# EasyEDA schematic SCH-Display_EasyEDA.json

## Sheets
1 Display_Sheet_1: TITLE: Sheet_1; REV: 1.0; Date: 2024-01-01; Sheet: 1/2; Drawn By: scottguiness; Company: Scott and Marco
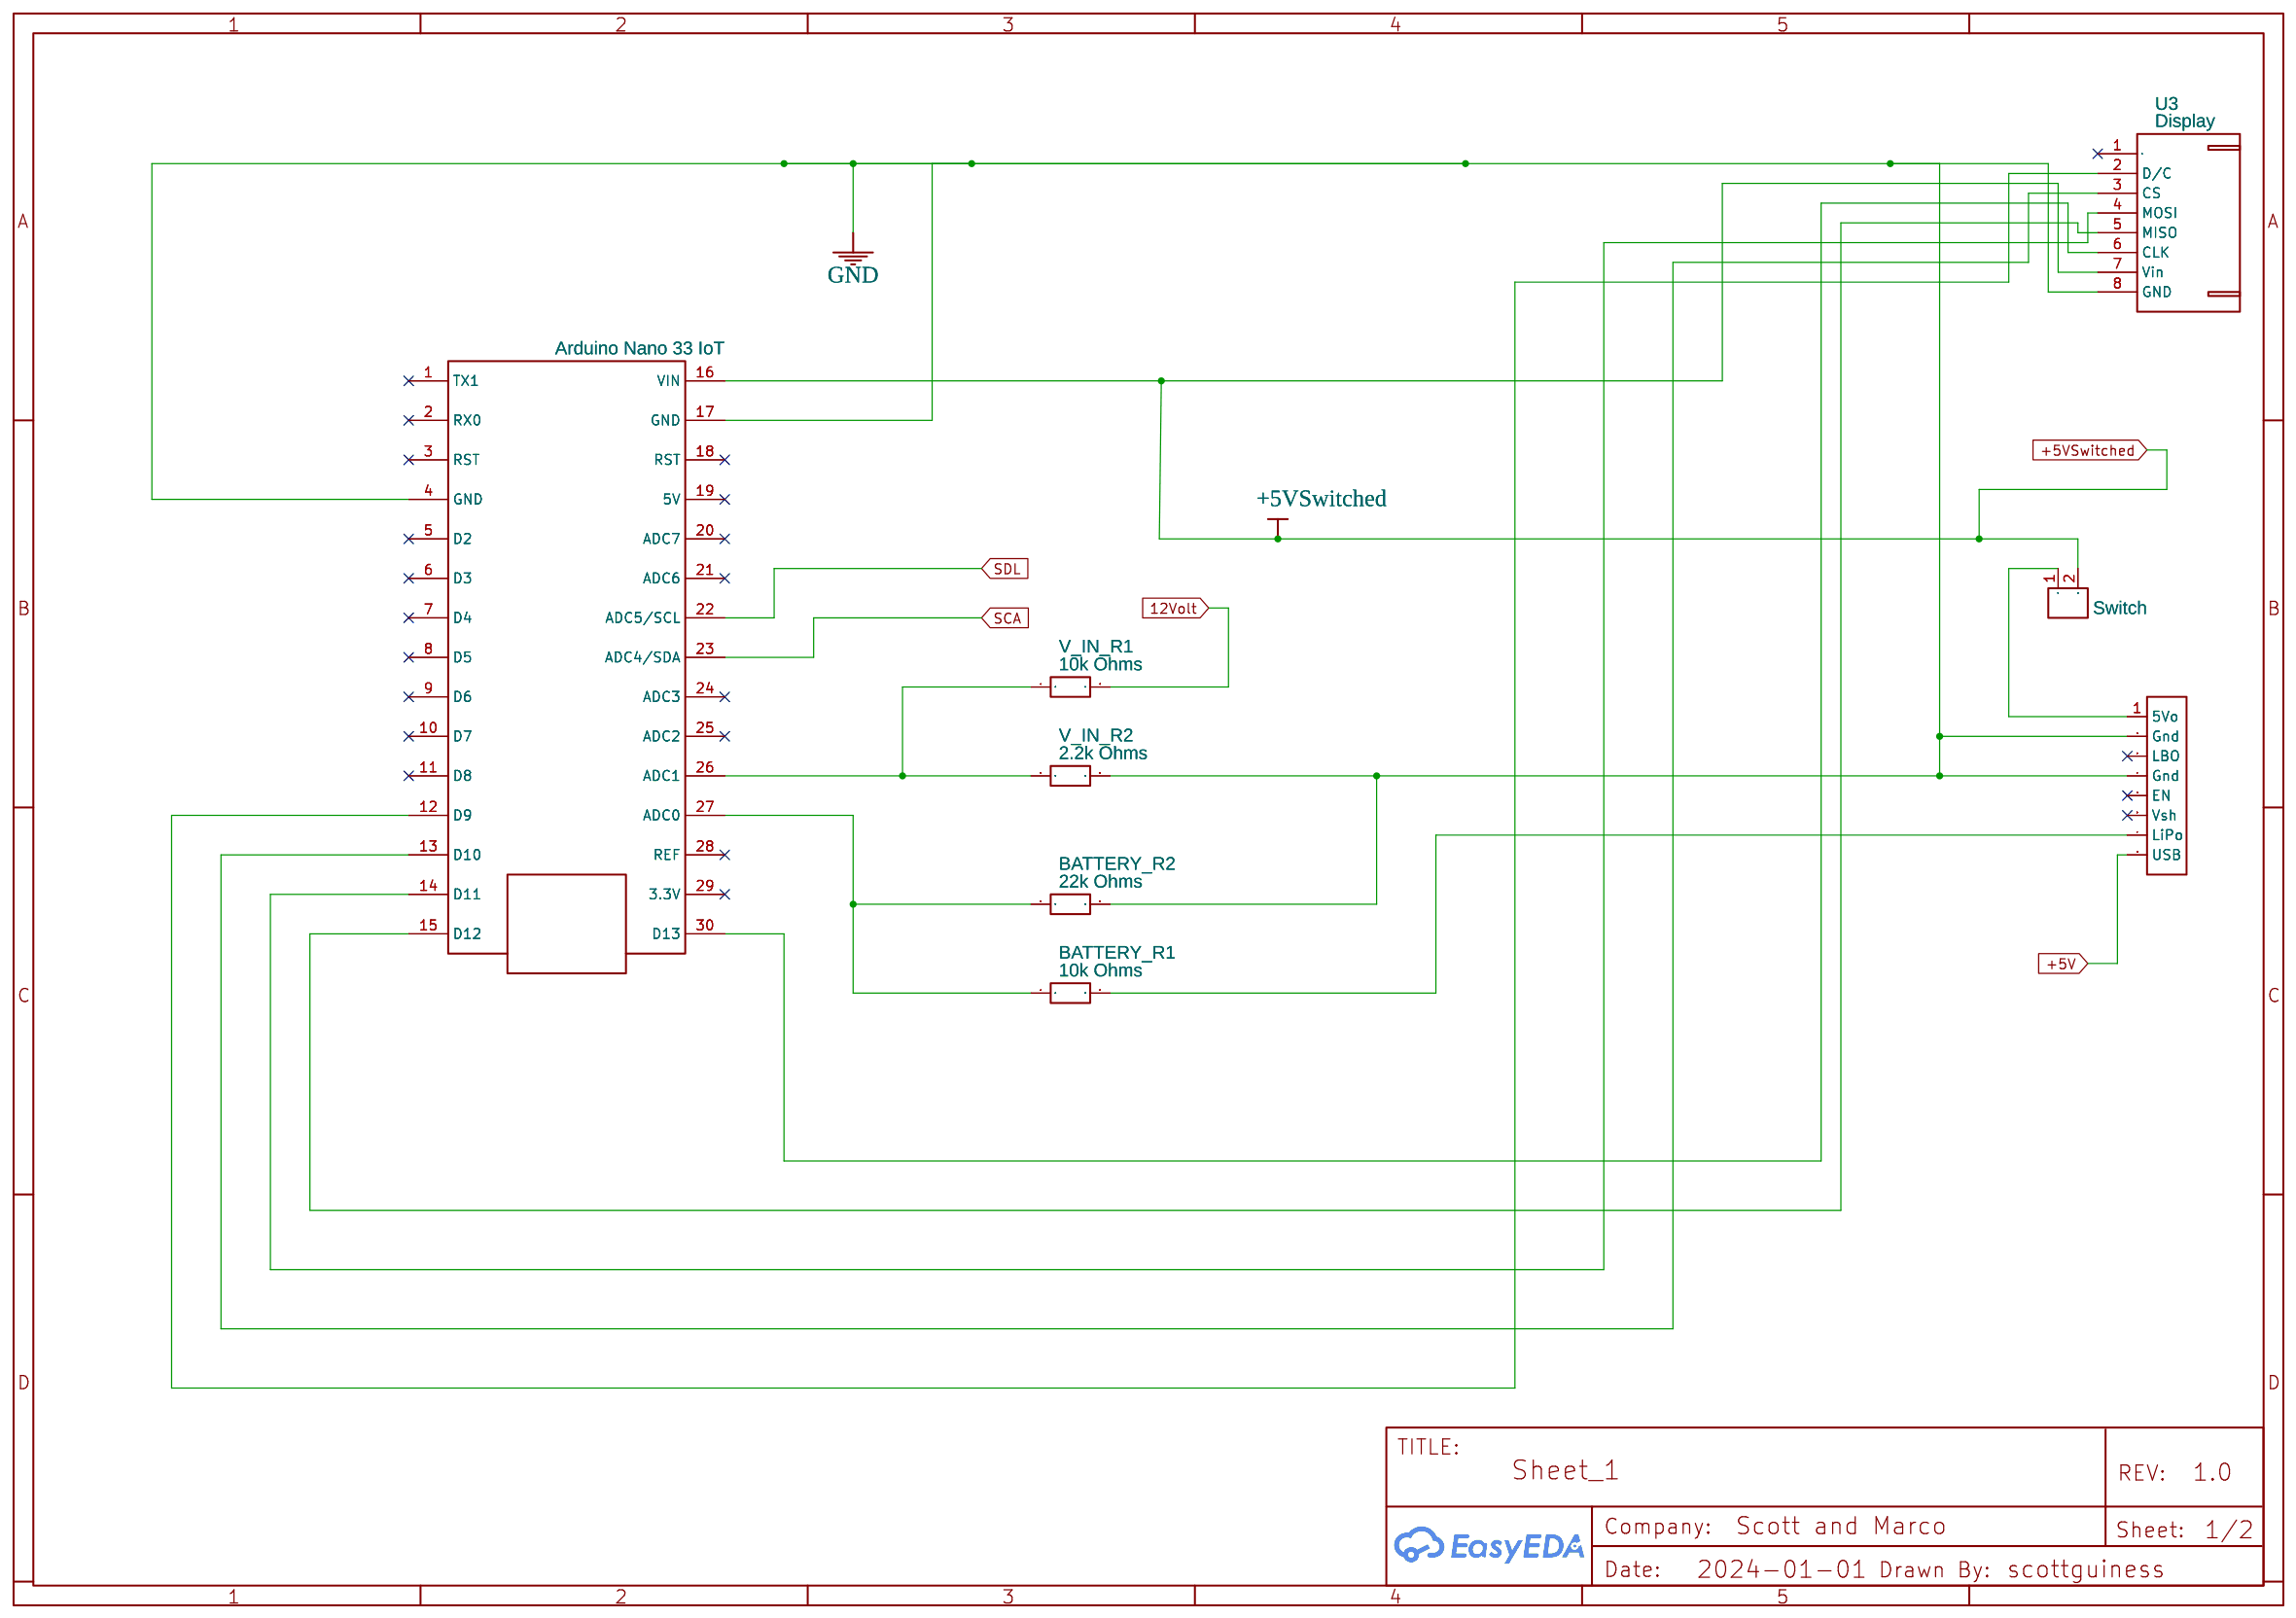
[diagram p0: Display_Sheet_1]
2 Display_Sheet_2: TITLE: Sheet_2; Date: 2024-01-03; Sheet: 2/2
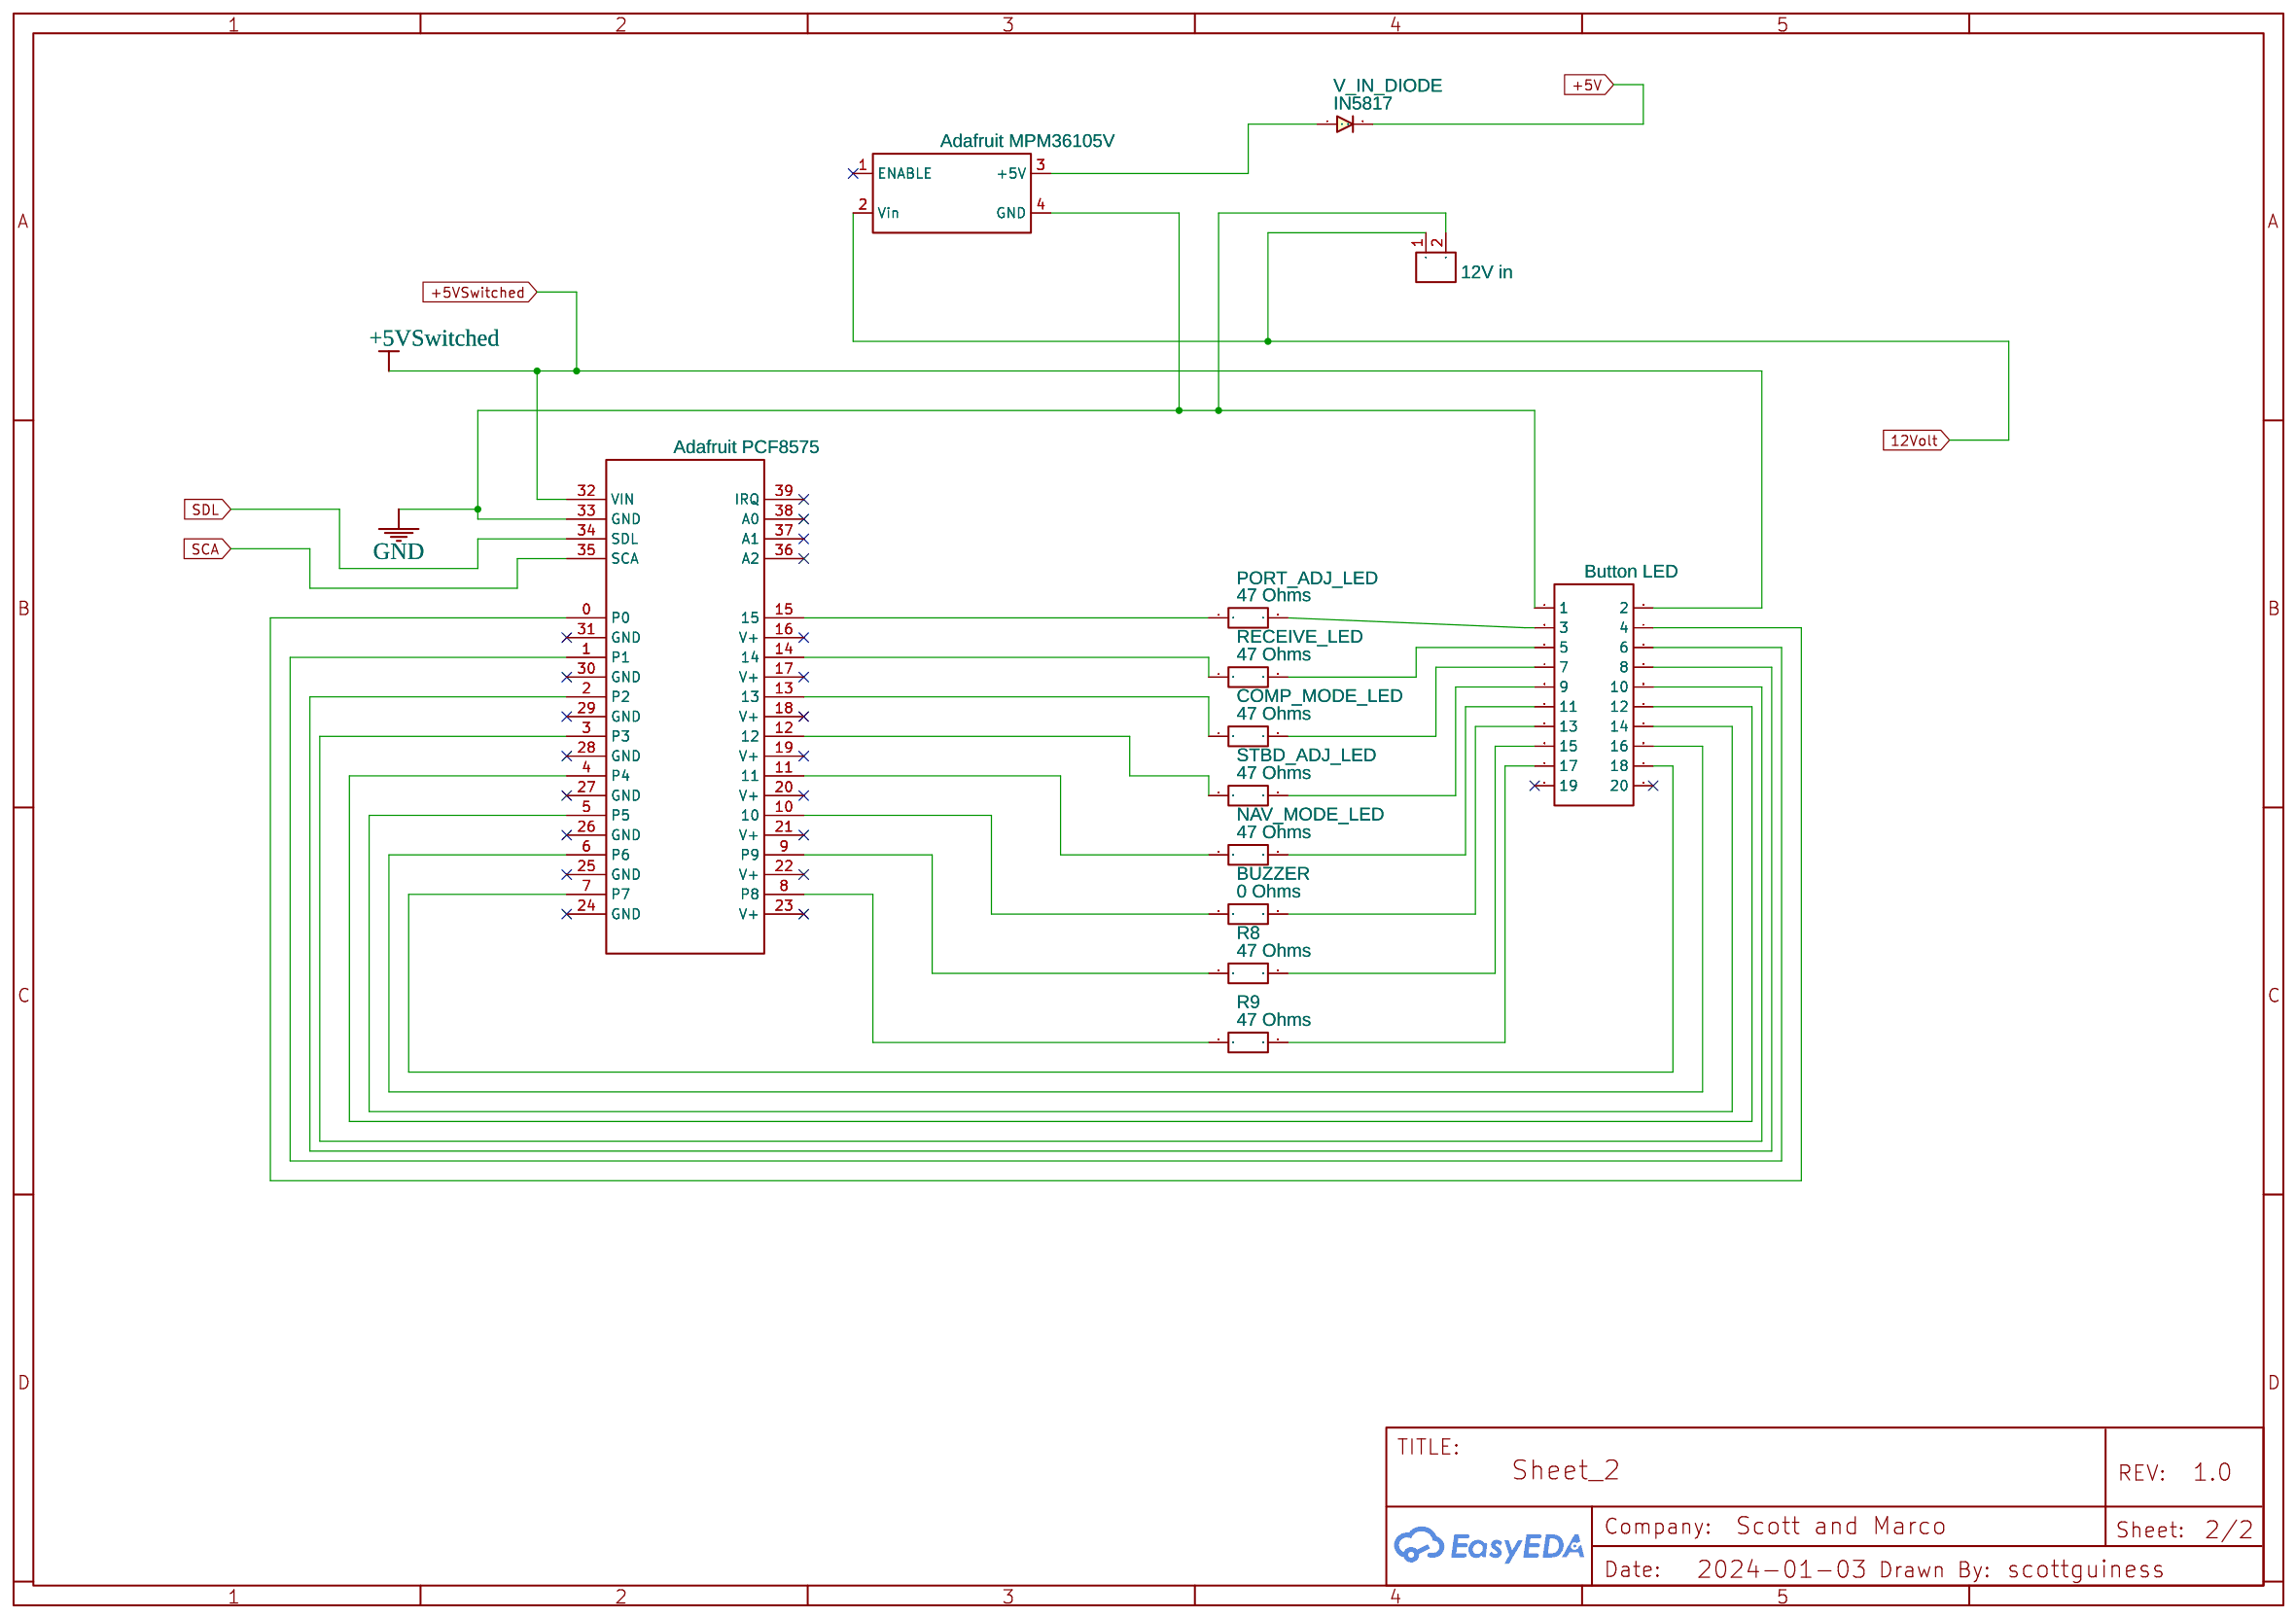
[diagram p1: Display_Sheet_2]

## Parts
sheet Display_Sheet_1
BATTERY_R1  10k Ohms  [2W RESITOR]
BATTERY_R2  22k Ohms  [2W RESITOR]
POWERBOOST  HDR-F-2.54_1x8  [HDR-F-2.54_1X8]
SWITCH  Switch  [JST-XHP-2-PIN]
U1  Arduino Nano 33 IoT  [ADUINO NANO R3]
U3  Display  [JST-XH-8-PIN]
V_IN_R1  10k Ohms  [2W RESITOR]
V_IN_R2  2.2k Ohms  [2W RESITOR]
sheet Display_Sheet_2
12V  12V in  [JST-XHP-2-PIN]
BUTTON_LED  Button LED  [HDR-M-2.54_2X10]
BUZZER  0 Ohms  [2W RESITOR]
COMP_MODE_LED  47 Ohms  [2W RESITOR]
NAV_MODE_LED  47 Ohms  [2W RESITOR]
PORT_ADJ_LED  47 Ohms  [2W RESITOR]
R8  47 Ohms  [2W RESITOR]
R9  47 Ohms  [2W RESITOR]
RECEIVE_LED  47 Ohms  [2W RESITOR]
STBD_ADJ_LED  47 Ohms  [2W RESITOR]
U2  Adafruit PCF8575  [ADAFRUIT-PCF8575]
U5  Adafruit MPM36105V  [ADAFRUIT_MPM3610_MODULE5]
V_IN_DIODE  IN5817  [DIODE NI RAMON]

## Library data of the parts
BATTERY_R1 BATTERY_R2 BUZZER COMP_MODE_LED NAV_MODE_LED PORT_ADJ_LED R8 R9 RECEIVE_LED STBD_ADJ_LED V_IN_R1 V_IN_R2 = 1w resistor: Contributor: Kagutsuchi
POWERBOOST = HDR-F-2.54_1x8: Supplier Part: C225505; Supplier: LCSC; Contributor: LCEDA_Lib
12V SWITCH = JST-XHP-2-PIN: Contributor: Grim Reaper (C0rbac)
U1 = ARDUINO_NANO_R3: Contributor: Nikolay Yanev
U3 = JST-XH-8-Pin: Contributor: loyboy
BUTTON_LED = HDR-M-2.54_2x10: Supplier Part: C124359; Supplier: LCSC; Contributor: LCEDA_Lib
U2 = ADAFRUIT-PCF8575: Contributor: williambaucom
U5 = ADAFRUIT_MPM36105V: Supplier: Digi-Key; JLCPCB Part Class: Extended Part; Contributor: Aidan Farley
V_IN_DIODE = in5004 diode: Manufacturer Part: DIODE; Contributor: mimit.oscar

## Nets
12Volt: 12V.1 U5.2(Vin) V_IN_R1.2(1)
+5V: POWERBOOST.8(USB) V_IN_DIODE.2
+5VSwitched: BUTTON_LED.2 SWITCH.2 U1.16(VIN) U2.32(VIN) U3.7(Vin)
GND: 12V.2 BATTERY_R2.2(1) BUTTON_LED.1 POWERBOOST.2(Gnd) POWERBOOST.4(Gnd) U1.4(GND) U1.17(GND) U2.33(GND) U3.8(GND) U5.4(GND) V_IN_R2.2(1)
SCA: U1.23(ADC4/SDA) U2.35(SCA)
SDL: U1.22(ADC5/SCL) U2.34(SDL)
Net-(BATTERY_R1-1): BATTERY_R1.1(2) BATTERY_R2.1(2) U1.27(ADC0)
Net-(BATTERY_R1-2): BATTERY_R1.2(1) POWERBOOST.7(LiPo)
Net-(BUTTON_LED-3): BUTTON_LED.3 PORT_ADJ_LED.2(1)
Net-(BUTTON_LED-4): BUTTON_LED.4 U2.0(P0)
Net-(BUTTON_LED-5): BUTTON_LED.5 RECEIVE_LED.2(1)
Net-(BUTTON_LED-6): BUTTON_LED.6 U2.1(P1)
Net-(BUTTON_LED-7): BUTTON_LED.7 COMP_MODE_LED.2(1)
Net-(BUTTON_LED-8): BUTTON_LED.8 U2.2(P2)
Net-(BUTTON_LED-9): BUTTON_LED.9 STBD_ADJ_LED.2(1)
Net-(BUTTON_LED-10): BUTTON_LED.10 U2.3(P3)
Net-(BUTTON_LED-11): BUTTON_LED.11 NAV_MODE_LED.2(1)
Net-(BUTTON_LED-12): BUTTON_LED.12 U2.4(P4)
Net-(BUTTON_LED-13): BUTTON_LED.13 BUZZER.2(1)
Net-(BUTTON_LED-14): BUTTON_LED.14 U2.5(P5)
Net-(BUTTON_LED-15): BUTTON_LED.15 R8.2(1)
Net-(BUTTON_LED-16): BUTTON_LED.16 U2.6(P6)
Net-(BUTTON_LED-17): BUTTON_LED.17 R9.2(1)
Net-(BUTTON_LED-18): BUTTON_LED.18 U2.7(P7)
Net-(BUZZER-1): BUZZER.1(2) U2.10
Net-(COMP_MODE_LED-1): COMP_MODE_LED.1(2) U2.13
Net-(NAV_MODE_LED-1): NAV_MODE_LED.1(2) U2.11
Net-(PORT_ADJ_LED-1): PORT_ADJ_LED.1(2) U2.15
Net-(POWERBOOST-1): POWERBOOST.1(5Vo) SWITCH.1
Net-(R8-1): R8.1(2) U2.9(P9)
Net-(R9-1): R9.1(2) U2.8(P8)
Net-(RECEIVE_LED-1): RECEIVE_LED.1(2) U2.14
Net-(STBD_ADJ_LED-1): STBD_ADJ_LED.1(2) U2.12
Net-(U1-12): U1.12(D9) U3.2(D/C)
Net-(U1-13): U1.13(D10) U3.3(CS)
Net-(U1-14): U1.14(D11) U3.4(MOSI)
Net-(U1-15): U1.15(D12) U3.5(MISO)
Net-(U1-26): U1.26(ADC1) V_IN_R1.1(2) V_IN_R2.1(2)
Net-(U1-30): U1.30(D13) U3.6(CLK)
Net-(U5-3): U5.3(+5V) V_IN_DIODE.1

Not connected (* = marked no-connect by the designer): BUTTON_LED 19* 20*; POWERBOOST 3(LBO)* 5(EN)* 6(Vsh)*; U1 1(TX1)* 2(RX0)* 3(RST)* 5(D2)* 6(D3)* 7(D4)* 8(D5)* 9(D6)* 10(D7)* 11(D8)* 18(RST)* 19(5V)* 20(ADC7)* 21(ADC6)* 24(ADC3)* 25(ADC2)* 28(REF)* 29(3.3V)*; U2 16(V+)* 17(V+)* 18(V+)* 19(V+)* 20(V+)* 21(V+)* 22(V+)* 23(V+)* 24(GND)* 25(GND)* 26(GND)* 27(GND)* 28(GND)* 29(GND)* 30(GND)* 31(GND)* 36(A2)* 37(A1)* 38(A0)* 39(IRQ)*; U3 1*; U5 1(ENABLE)*
